# EAGLE design SparkFun_Simultaneous_RFID_Reader_M7E (EAGLE 9.6.2)
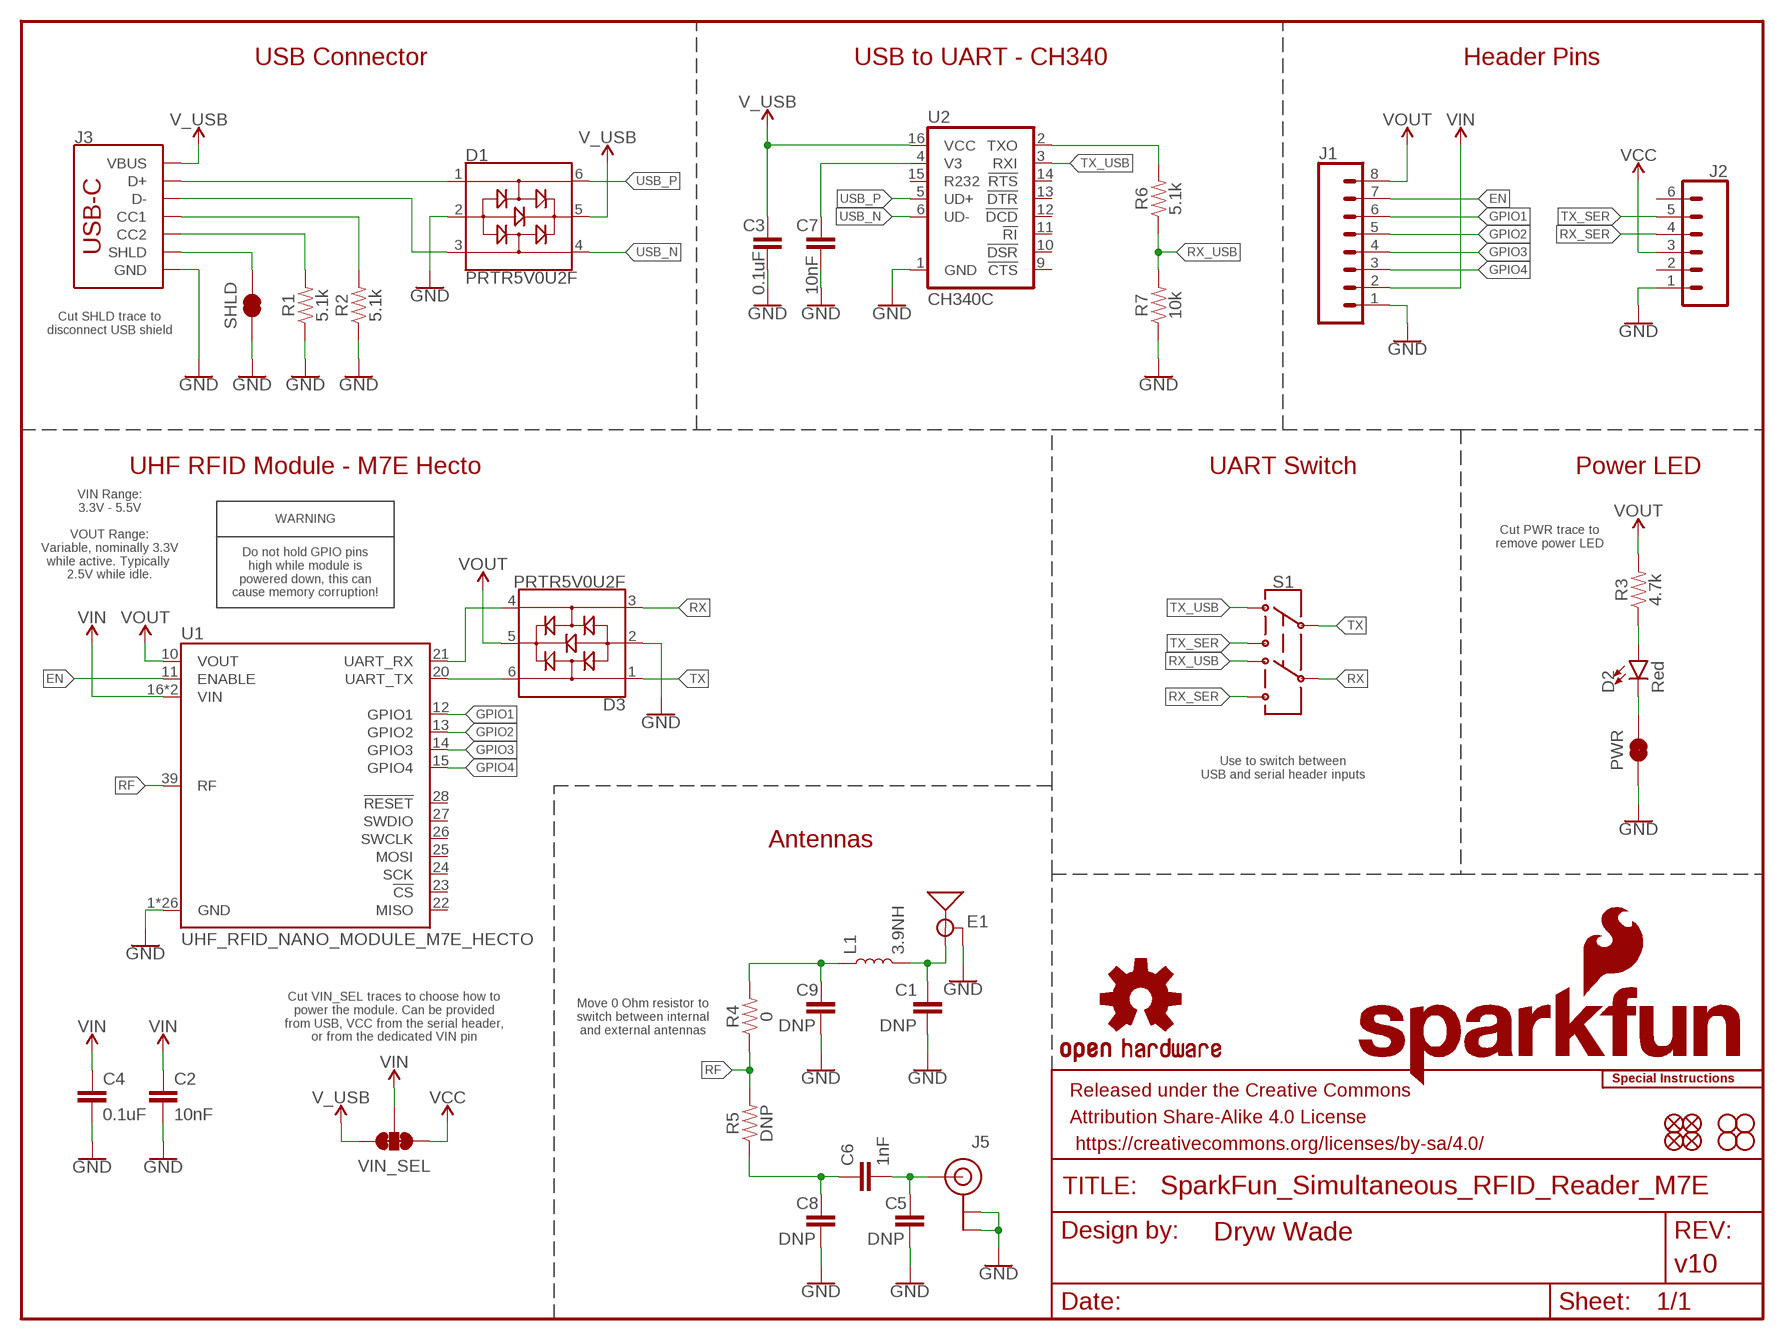
[diagram p0: schematic, sheet 1]

## Parts
C1  DNP  1.0PF-0603-50V-25%  [0603]
C2  10nF  10NF-0603-50V-10%  [0603]
C3  0.1uF  0.1UF-0603-25V-(+80/-20%)  [0603]
C4  0.1uF  0.1UF-0603-25V-(+80/-20%)  [0603]
C5  DNP  1.0PF-0603-50V-25%  [0603]
C6  1nF  1.0NF/1000PF-0603-50V-10%  [0603]
C7  10nF  10NF-0603-50V-10%  [0603]
C8  DNP  1.0PF-0603-50V-25%  [0603]
C9  DNP  1.0PF-0603-50V-25%  [0603]
D1  PRTR5V0U2F  [SOT886]
D2  Red  LED-RED_0603-KB  [LED-0603]
D3  PRTR5V0U2F  [SOT886]
E1  ANTENNA-GROUNDEDTRACE-915MHZ  [TRACE_ANTENNA_915MHZ_THINGMAGIC]
FD1  FIDUCIAL1X2  [FIDUCIAL-1X2]
FD2  FIDUCIAL1X2  [FIDUCIAL-1X2]
FD3  FIDUCIAL1X2  [FIDUCIAL-1X2]
FD4  FIDUCIAL1X2  [FIDUCIAL-1X2]
FRAME1  FRAME-LETTER  [CREATIVE_COMMONS]
H1  STAND-OFF  [STAND-OFF]
H2  STAND-OFF  [STAND-OFF]
H3  STAND-OFF  [STAND-OFF]
H4  STAND-OFF  [STAND-OFF]
J1  CONN_08NO_SILK_DNP  [1X08_NO_SILK]
J2  CONN_06NO_SILK_NO_POP  [1X06_NO_SILK]
J3  USB_C_2-LAYER_PADS  [USB-C-16P-2LAYER-PADS]
J5  U.FL  [U.FL]
L1  3.9NH  [0603]
LOGO1  OSHW-LOGOM  [OSHW-LOGO-M]
LOGO2  SFE_LOGO_NAME_FLAME.2_INCH  [SFE_LOGO_NAME_FLAME_.2]
LOGO3  SFE_LOGO_NAME_FLAME.2_INCH  [SFE_LOGO_NAME_FLAME_.2]
LOGO4  SPECIAL_INSTRUCTIONS-ORDERING  [ORDERING_INSTRUCTIONS]
PWR  JUMPER-SMT_2_NC_TRACE_SILK  [SMT-JUMPER_2_NC_TRACE_SILK]
R1  5.1k  5.1KOHM5.1KOHM-0603-1/10W-1%  [0603]
R2  5.1k  5.1KOHM5.1KOHM-0603-1/10W-1%  [0603]
R3  4.7k  4.7KOHM-0603-1/10W-1%  [0603]
R4  0  0OHM-0603-1/10W  [0603]
R5  DNP  0OHM-0603-1/10W  [0603]
R6  5.1k  5.1KOHM5.1KOHM-0603-1/10W-1%  [0603]
R7  10k  10KOHM-0603-1/10W-1%  [0603]
S1  SWITCH-DPDT-SMD-AYZ0202  [SWITCH_DPDT_SMD_AYZ0202]
SHLD  JUMPER-SMT_2_NC_TRACE_SILK  [SMT-JUMPER_2_NC_TRACE_SILK]
U1  UHF_RFID_NANO_MODULE_M7E_HECTO  [M7E_HECTO_MODULE]
U2  CH340C  [SO016]
VIN_SEL  JUMPER-SMT_3_2-NC_TRACE_SILK  [SMT-JUMPER_3_2-NC_TRACE_SILK]

## Nets
EN: J1.7 U1.11(ENABLE)
GND: C1.2 C2.2 C3.2 C4.2 C5.2 C7.2 C8.2 C9.2 D1.2 D3.2 E1.GND@1(GND) E1.GND@2(GND) E1.GND@3(GND) J1.1 J2.1 J3.GND J3.GND2(GND) J5.1(GND) J5.2(GND) PWR.1 R1.1 R2.1 R7.1 SHLD.1 U1.1(GND) U1.2(GND) U1.3(GND) U1.4(GND) U1.5(GND) U1.6(GND) U1.7(GND) U1.8(GND) U1.9(GND) U1.18(GND) U1.19(GND) U1.29(GND) U1.30(GND) U1.31(GND) U1.32(GND) U1.33(GND) U1.34(GND) U1.35(GND) U1.36(GND) U1.37(GND) U1.38(GND) U1.40(GND) U1.41(GND) U1.GND_PAD1(GND) U1.GND_PAD2(GND) U1.GND_PAD3(GND) U2.1(GND)
GPIO1: J1.6 U1.12(GPIO1)
GPIO2: J1.5 U1.13(GPIO2)
GPIO3: J1.4 U1.14(GPIO3)
GPIO4: J1.3 U1.15(GPIO4)
N$1: C1.1 E1.ANT(SIGNAL) L1.2
N$2: D2.A R3.1
N$3: J3.B5(CC2) R1.2
N$4: J3.A5(CC1) R2.2
N$5: D1.1 J3.A6(D+) J3.B6(D+)
N$6: D2.C PWR.2
N$7: D1.3 J3.A7(D-) J3.B7(D-)
N$8: C6.1 C8.1 R5.1
N$9: C5.1 C6.2 J5.FEED(SIGNAL)
N$10: C9.1 L1.1 R4.2
N$11: C7.1 U2.4(V3)
N$12: D3.6 U1.20(UART_TX)
N$13: D3.4 U1.21(UART_RX)
N$14: R6.2 U2.2(TXO)
RF: R4.1 R5.2 U1.39(RF)
RX: D3.3 S1.5
RX_SER: J2.4 S1.4
RX_USB: R6.1 R7.2 S1.6
SHLD: J3.SHLD1(SHLD) J3.SHLD2(SHLD) J3.SHLD3(SHLD) J3.SHLD4(SHLD) SHLD.2
TX: D3.1 S1.2
TX_SER: J2.5 S1.1
TX_USB: S1.3 U2.3(RXI)
USB_N [USB]: D1.4 U2.6(UD-)
USB_P [USB]: D1.6 U2.5(UD+)
V_USB: C3.1 D1.5 J3.VBUS1(VBUS) J3.VBUS2(VBUS) U2.16(VCC) VIN_SEL.3
VCC: J2.3 VIN_SEL.1
VIN: C2.1 C4.1 J1.2 U1.16(VIN) U1.17(VIN) VIN_SEL.2
VOUT: D3.5 J1.8 R3.2 U1.10(VOUT)
Unconnected: J2.2 J2.6 U1.22(MISO) U1.23(!CS) U1.24(SCK) U1.25(MOSI) U1.26(SWCLK) U1.27(SWDIO) U1.28(!RESET) U2.9(!CTS) U2.10(!DSR) U2.11(!RI) U2.12(!DCD) U2.13(!DTR) U2.14(!RTS) U2.15(R232)

## Notes on the sheet
- USB Connector | USB to UART - CH340 | Header Pins
- Cut SHLD trace to
  disconnect USB shield
- UHF RFID Module - M7E Hecto | UART Switch | Power LED
- VIN Range:
  3.3V - 5.5V
- WARNING
- Cut PWR trace to
  remove power LED
- VOUT Range:
  Variable, nominally 3.3V
  while active. Typically 
  2.5V while idle.
- Do not hold GPIO pins
  high while module is
  powered down, this can
  cause memory corruption!
- Use to switch between
  USB and serial header inputs
- Antennas
- Cut VIN_SEL traces to choose how to
  power the module. Can be provided
  from USB, VCC from the serial header,
  or from the dedicated VIN pin
- Move 0 Ohm resistor to
  switch between internal
  and external antennas

## Library data of the parts
C1 C5 C8 C9 = SparkFun-Capacitors:1.0PF: 1pF ceramic capacitors A capacitor is a passive two-terminal electrical component used to store electrical energy temporarily in an electric field.; VALUE: 1.0pF
C2 C7 = SparkFun-Capacitors:10NF: 0.01uF/10nF/10,000pF ceramic capacitors A capacitor is a passive two-terminal electrical component used to store electrical energy temporarily in an electric field. CAP-09321; PROD_ID: CAP-00867
C3 C4 = SparkFun-Capacitors:0.1UF: 0.1µF ceramic capacitors A capacitor is a passive two-terminal electrical component used to store electrical energy temporarily in an electric field.; PROD_ID: CAP-00810
C6 = SparkFun-Capacitors:1.0NF/1000PF: 1nF/1,000pF ceramic capacitors A capacitor is a passive two-terminal electrical component used to store electrical energy temporarily in an electric field.; PROD_ID: CAP-07886
D1 D3 = SparkFun-IC-Power:PRTR5V0U2: A small ESD protection device. Most commonly used on USB D+/D- signals to protect large, expensive, or especially sensitive USB enabled devices.; PROD_ID: DIO-14084
D2 = SparkFun-LED:LED-RED: Red SMD LED Used in manufacturing of most products at SparkFun Packages: 0603 - KB - KingBright (DIO-17976) SMD 0603 package [Datasheet] <https://www.kingbrightusa.com/images/catalog/SPEC/APT1608SURCK.pdf> 0603 - (DIO-00819, has gone EOL) SMD 0603 package 0603 SMART - SMD 0603 SMART package ( more efficient and expensive)[Product Link] <http://www.osram-os.com/Graphics/XPic2/00077099_0.pdf> 1206 - SMD1206 package [Product Link] <https://www.sparkfun.com/datasheets/DevTools/LilyPad/Q150OVS4.pdff> SparkFun Products: Pro Mini 328 -5V <https://www.sparkfun.com/products/821> RedBoard <https://www.sparkfun.com/products/12757> IOIO-OTG <https://www.sparkfun.com/products/13613>; PROD_ID: DIO-17976
E1 = SparkFun-RF:ANTENNA-GROUNDED: Antenna w/ Ground Connection 2.4GHz antennae with signal and ground terminals. TRACE_ANTENNA_2.4GHZ_15.2MM - Meander Trace antenna 15.2 x 5.7mm footprint Based on layout from TI app note AN043 <http://www.ti.com/lit/an/swra117d/swra117d.pdf>. TRACE_ANTENNA_2.4GHZ_25.7MM - Inverted F trace antenna 25.7 x 7.5 mm footprint. Based on layout from TI design note DN0007 <http://www.ti.com/lit/an/swru120b/swru120b.pdf>.
FD1-FD4 = SparkFun-Aesthetics:FIDUCIAL: Fiducial Alignment Points Point-of-reference for pick-and-place machines and other optical instruments.
FRAME1 = SparkFun-Aesthetics:FRAME-LETTER: Schematic Frame - Letter Standard 8.5x11 US Letter frame; DESIGNER: Dryw Wade; REV: v10
H1-H4 = SparkFun-Hardware:STAND-OFF: Stand Off Drill holes for mechanically mounting via screws, standoffs, etc. Note: Use the keepout ring to avoid running the screw head into surrounding components. Variant Overviews STAND-OFF - Mechanical footprint for a #4 phillips button head screw. STAND-OFF-TIGHT - Mechanical footprint for a #4 phillips button head screw, Example SparkFun Products Screw - Phillips Head (1/4", 4-40, 10 pack) <https://www.sparkfun.com/products/10453> (PRT-10453) Screw - Phillips Head (1/2", 4-40, 10 pack) <https://www.sparkfun.com/products/10452> (PRT-10452) Screw - Phillips Head (3/4", 4-40, 10 pack) <https://www.sparkfun.com/products/10451> (PRT-10451) Screw - Phillips Head (1", 4-40, 10 pack) <https://www.sparkfun.com/products/10450> (PRT-10450)
J1 = SparkFun-Connectors:CONN_08: Multi connection point. Often used as Generic Header-pin footprint for 0.1 inch spaced/style header connections On any of the 0.1 inch spaced packages, you can populate with these: Break Away Headers - Straight <https://www.sparkfun.com/products/116> (PRT-00116) Break Away Male Headers - Right Angle <https://www.sparkfun.com/products/553> (PRT-00553) Female Headers <https://www.sparkfun.com/products/115> (PRT-00115) Break Away Headers - Machine Pin <https://www.sparkfun.com/products/117> (PRT-00117) Break Away Female Headers - Swiss Machine Pin <https://www.sparkfun.com/products/743> (PRT-00743) Arduino Stackable Header - 8 Pin <https://www.sparkfun.com/products/9279> (PRT-09279) For SCREWTERMINALS and SPRING TERMINALS visit here: Screw Terimnals on SparkFun.com <https://www.sparkfun.com/search/results?term=Screw+Terminals> (5mm/3.5mm/2.54mm spacing) This device is also useful as a general connection point to wire up your design to another part of your project. Our various solder wires solder well into these plated through hole pads. Hook-Up Wire - Assortment (Stranded, 22 AWG) <https://www.sparkfun.com/products/11375> (PRT-11375) Hook-Up Wire - Assortment (Solid Core, 22 AWG) <https://www.sparkfun.com/products/11367> (PRT-11367) View the entire wire category on our website here <https://www.sparkfun.com/categories/141> Special notes: Molex polarized connector foot print use with SKU : PRT-08231 with associated crimp pins and housings. 1MM SMD Version SKU: PRT-10208 NOTES ON THE VARIANTS LOCK and LOCK_LONGPADS... This footprint was designed to help hold the alignment of a through-hole component (i.e. 6-pin header) while soldering it into place. You may notice that each hole has been shifted either up or down by 0.005 of an inch from it's more standard position (which is a perfectly straight line). This slight alteration caused the pins (the squares in the middle) to touch the edges of the holes. Because they are alternating, it causes a "brace" to hold the component in place. 0.005 has proven to be the perfect amount of "off-center" position when using our standard breakaway headers. Although looks a little odd when you look at the bare footprint, once you have a header in there, the alteration is very hard to notice. Also,if you push a header all the way into place, it is covered up entirely on the bottom side.
J2 = SparkFun-Connectors:CONN_06: Multi connection point. Often used as Generic Header-pin footprint for 0.1 inch spaced/style header connections On any of the 0.1 inch spaced packages, you can populate with these: Break Away Headers - Straight <https://www.sparkfun.com/products/116> (PRT-00116) Break Away Male Headers - Right Angle <https://www.sparkfun.com/products/553> (PRT-00553) Female Headers <https://www.sparkfun.com/products/115> (PRT-00115) Break Away Headers - Machine Pin <https://www.sparkfun.com/products/117> (PRT-00117) Break Away Female Headers - Swiss Machine Pin <https://www.sparkfun.com/products/743> (PRT-00743) Arduino Stackable Header - 6 Pin <https://www.sparkfun.com/products/9280> (PRT-09280) Screw Terminals 2.54mm Pitch (6-Pin) <https://www.sparkfun.com/products/16499> (PRT-16499) For SCREWTERMINALS and SPRING TERMINALS visit here: Screw Terimnals on SparkFun.com <https://www.sparkfun.com/search/results?term=Screw+Terminals> (5mm/3.5mm/2.54mm spacing) This device is also useful as a general connection point to wire up your design to another part of your project. Our various solder wires solder well into these plated through hole pads. Hook-Up Wire - Assortment (Stranded, 22 AWG) <https://www.sparkfun.com/products/11375> (PRT-11375) Hook-Up Wire - Assortment (Solid Core, 22 AWG) <https://www.sparkfun.com/products/11367> (PRT-11367) View the entire wire category on our website here <https://www.sparkfun.com/categories/141>
J3 = SparkFun-Connectors:USB_C: USB Type C 16Pin Connector Super Speed pins not available on the 16-pin purely SMD connector so this part is best for USB 2.0 implementations. D1 and D2 are tied together enabling D+/- no matter which way the cable is plugged into the connector. The two channel configuration pins (CC1/2) are exposed. These are normally connected to ground via 5.1k resistors but can be reconfigured for high current/high power applications. **4-LAYER BOARD WARNING!!** If designing 4-layer board, make sure to select the variant _4-LAYER-ISOLATED. The linked footprint (USB-C-16-4LAYER-ISOLATED) includes some very necessary cutout polygons in the inner layers (2 and 15). This prevents the PTH mounting shield legs on the USB connector from electrically connecting any other polygons on the inner layers (usually VCC and GND).; PROD_ID: CONN-14122
J5 = SparkFun-Connectors:U.FL: SMD Antenna Connector - U.FL 2mm height, 3.0mm x 3.0mm receptacle size. SparkFun Products: SparkFun WiFi Shield - ESP8266 <https://www.sparkfun.com/products/13287> SparkFun ESP8266 Thing <https://www.sparkfun.com/products/13231> SparkFun MiniGen - Pro Mini Signal Generator Shield <https://www.sparkfun.com/products/11420>; PROD_ID: CONN-09193; SF_ID: WRL-09144
L1 = SparkFun-Coils:3.9NH; PROD_ID: NDUC-08761
LOGO1 = SparkFun-Aesthetics:OSHW-LOGO: Open-Source Hardware (OSHW) Logo This logo indicates the piece of hardware it is found on incorporates a OSHW license and/or adheres to the definition of open source hardware found here: http://freedomdefined.org/OSHW
LOGO2 LOGO3 = SparkFun-Aesthetics:SFE_LOGO_NAME_FLAME: SparkFun Font Logo w/ Flame This is the SparkFun full logo. The logo on the schematic will always be the same size; the package variant is the height of the flame part of the logo. Default layer for the logo on the board is tSilk.
LOGO4 = SparkFun-Aesthetics:SPECIAL_INSTRUCTIONS: Special Ordering/Production Instructions Alert Symbol for special PCB ordering instructions or unique production process warnings. Ordering Instructions Production Instructions Types of information that should be added to box: Copper weight Soldermask color Silk color PCB thickness Number of layers PCB Standard: 1.6mm FR4 1 oz copper immersion silver plating red soldermask white silkscreen Types of information that should be added to box: Special wash requirements Depaneling instructions Humidification Glue curing Default text settings: 0.07 inch 9% ratio 50% line distance
PWR SHLD = SparkFun-Jumpers:JUMPER-SMT_2_NC_TRACE: Normally closed trace jumper This jumper has a trace between two pads so it's normally closed (NC). Use a razor knife to open the connection. For best results follow the IPC guidelines for cutting traces: Cutout at least 0.063 mm (0.005 in). Remove all loose material to clean up the cut area. Seal the cut with an approved epoxy. Reapply solder to reclose the connection.
R1 R2 R6 = SparkFun-Resistors:5.1KOHM; PROD_ID: RES-12083
R3 = SparkFun-Resistors:4.7KOHM: 4.7kΩ resistor A resistor is a passive two-terminal electrical component that implements electrical resistance as a circuit element. Resistors act to reduce current flow, and, at the same time, act to lower voltage levels within circuits. - Wikipedia; PROD_ID: RES-07857
R4 = SparkFun-Resistors:0OHM: 0Ω resistor A resistor is a passive two-terminal electrical component that implements electrical resistance as a circuit element. Resistors act to reduce current flow, and, at the same time, act to lower voltage levels within circuits. - Wikipedia; PROD_ID: RES-08609
R5 = SparkFun-Resistors:0OHM: 0Ω resistor A resistor is a passive two-terminal electrical component that implements electrical resistance as a circuit element. Resistors act to reduce current flow, and, at the same time, act to lower voltage levels within circuits. - Wikipedia; VALUE: 0
R7 = SparkFun-Resistors:10KOHM: 10kΩ resistor A resistor is a passive two-terminal electrical component that implements electrical resistance as a circuit element. Resistors act to reduce current flow, and, at the same time, act to lower voltage levels within circuits. - Wikipedia; PROD_ID: RES-00824
S1 = SparkFun-Switches:SWITCH-DPDT: Double-Pole, Double-Throw (DPDT) Switch Double-pole, double-throw switches. Variant Overview PTH-GPI-152-3013 Used on SparkFun Geiger Counter <https://www.sparkfun.com/products/11345> SMD-AY0202 Surface Mount DPDT Switch <https://www.sparkfun.com/products/597> (COM-00597) Used on e.g. LilyPad Arduino USB - ATmega32U4 Board <https://www.sparkfun.com/products/12049>; PROD_ID: SWCH-08179; SF_SKU: COM-00597
U1 = SparkFun-RF:UHF_RFID_NANO_MODULE: UHF 860 and 920MHz RFID Module from ThingMagic; PROD_ID: IC-21210
U2 = SparkFun-IC-Comms:CH340C; PROD_ID: IC-14038
VIN_SEL = SparkFun-Jumpers:JUMPER-SMT_3_2-NC_TRACE: Normally closed trace jumper (2 of 2 connections) This jumper has a trace between all three pads so they are normally closed (NC). Use a razor knife to open the connection(s). For best results follow the IPC guidelines for cutting traces: Cutout at least 0.063 mm (0.005 in). Remove all loose material to clean up the cut area. Seal the cut with an approved epoxy. Reapply solder to reclose the connection(s).

## Net classes
1 USB: width 0.185 mm, clearance 0.127 mm

## Board
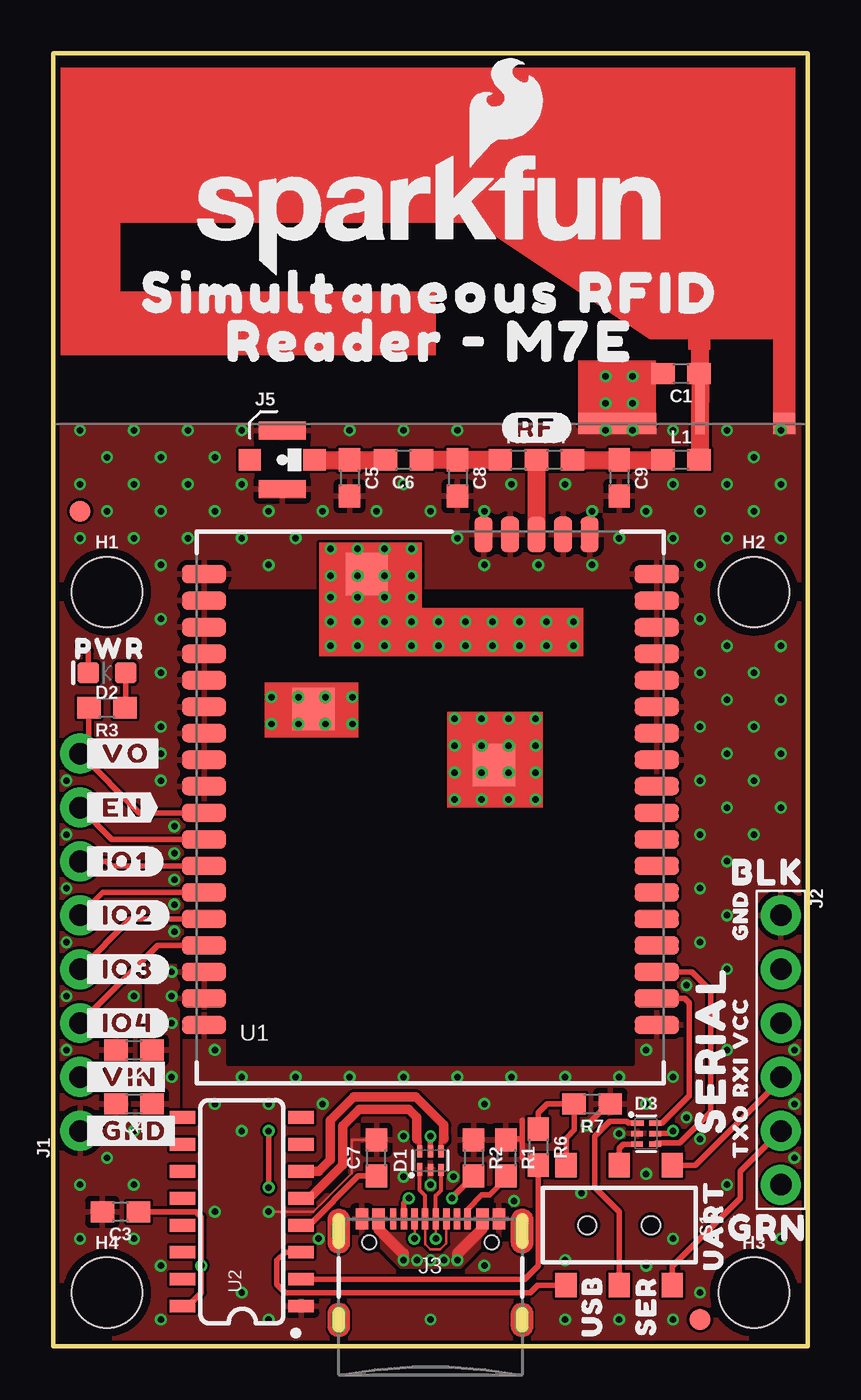
[diagram p1: board, top side]
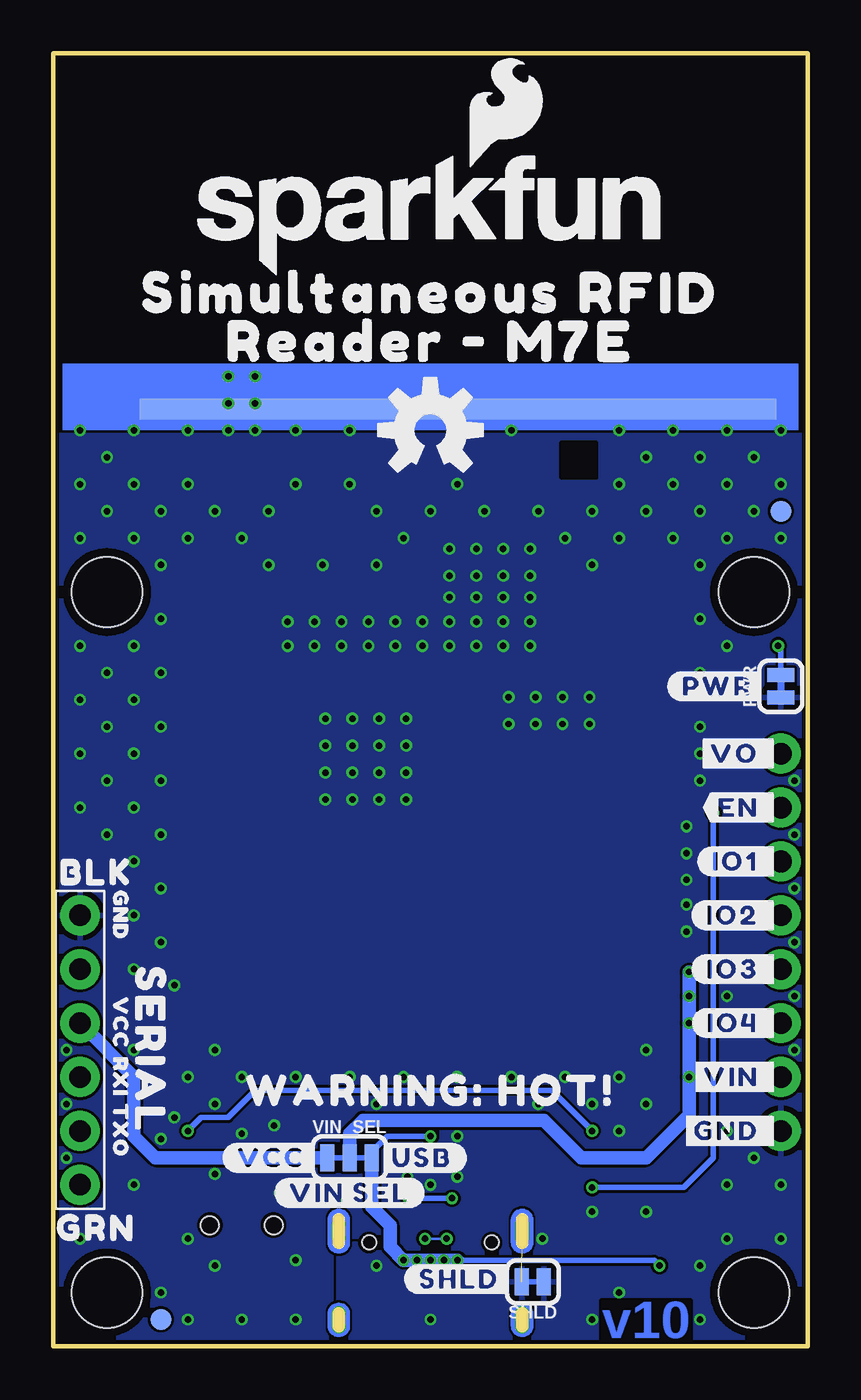
[diagram p2: board, bottom side, seen from below]

Size 35.56 x 60.96 mm. Coordinates in mm from the lower left corner, seen from the top.
Outline: 0,0 35.56,0 35.56,60.96 0,60.96 0,0
Copper layers (1*16): Top 0.035mm / dielectric 1.5mm / Bottom 0.035mm
Design rules "SparkFun-2-Layer-Minimum-JLCPCB": minimum track width 5mil, minimum drill 0.3mm, track to track 5mil, track to pad 5mil, pad to pad 5mil, via to via 5mil, smd to smd 5mil, copper to edge 7mil, drill to drill 7mil, minimum pad ring 5mil, minimum via ring 5mil, stop-mask expansion 2.5mil, vias tented up to drill 25mil, thermal gap 10mil
tRestrict: area 16.3,41.3 to 16.8,42.3; area 21.7,41.3 to 22.2,42.3; area 23.4,41.3 to 23.9,42.3; area 29.3,41.3 to 29.8,42.3

### Footprints (pad centres in the part's own frame; a part is rotated, then mirrored left to right if it is on the bottom)
0603 = smd 1.1 x 1: 1 -0.85,0; 2 0.85,0
SOT886 = smd 0.61 x 0.25: 1 -0.405,0.5 | smd 0.56 x 0.25: 2 -0.43,0; 3 -0.43,-0.5; 4 0.43,-0.5; 5 0.43,0; 6 0.43,0.5
LED-0603 = smd 1 x 1: A -0.877,0; C 0.877,0
TRACE_ANTENNA_915MHZ_THINGMAGIC = smd 0.44 x 3: ANT -0.006,-1.315 | smd 1.02 x 1: GND@1 -3.966,-0.315 | smd 3.677 x 1: GND@2 3.909,-0.315 | smd 30 x 1 bottom: GND@3 14,-1
FIDUCIAL-1X2 = smd 1 x 1: 1 0,0
STAND-OFF = hole 3.302: 0,0
1X08_NO_SILK = drill 1.016 pad 1.88: 1 0,0; 2 2.54,0; 3 5.08,0; 4 7.62,0; 5 10.16,0; 6 12.7,0; 7 15.24,0; 8 17.78,0
1X06_NO_SILK = drill 1.016 pad 1.88: 1 0,0; 2 2.54,0; 3 5.08,0; 4 7.62,0; 5 10.16,0; 6 12.7,0
USB-C-16P-2LAYER-PADS = smd 0.3 x 1: A5 -1.25,-0.34; A6 -0.25,-0.34; A7 0.25,-0.34; A8 1.25,-0.34; B5 1.75,-0.34; B6 0.75,-0.34; B7 -0.75,-0.34; B8 -1.75,-0.34 | smd 0.6 x 1: GND -3.225,-0.34; GND2 3.225,-0.34; VBUS1 -2.45,-0.34; VBUS2 2.45,-0.34 | drill 0.4 pad 0.6 long: SHLD1 -4.318,-0.915; SHLD2 4.318,-0.915; SHLD3 -4.318,-5.095; SHLD4 4.318,-5.095 | hole 0.65: -2.89,-1.445; 2.89,-1.445
U.FL = smd 2.2 x 0.85: 1 0,1.375; 2 0,-1.375 | smd 1.05 x 1: FEED 1.525,0; NC -1.525,0
SMT-JUMPER_2_NC_TRACE_SILK = smd 0.66 x 1.27: 1 -0.521,0; 2 0.521,0
SWITCH_DPDT_SMD_AYZ0202 = smd 1 x 1.15: 1 -2.5,2.825; 2 0,2.825; 3 2.5,2.825; 4 -2.5,-2.825; 5 0,-2.825; 6 2.5,-2.825 | hole 0.85: 1.5,0; -1.5,0
M7E_HECTO_MODULE = smd 2.075 x 0.85: 1 -10.662,11; 2 -10.662,9.75; 3 -10.662,8.5; 4 -10.662,7.25; 5 -10.662,6; 6 -10.662,4.75; 7 -10.662,3.5; 8 -10.662,2.25; 9 -10.662,1; 10 -10.662,-0.25; 11 -10.662,-1.5; 12 -10.662,-2.75; 13 -10.662,-4; 14 -10.662,-5.25; 15 -10.662,-6.5; 16 -10.662,-7.75; 17 -10.662,-9; 18 -10.662,-10.25; 19 10.662,-10.25; 20 10.662,-9; 21 10.662,-7.75; 22 10.662,-6.5; 23 10.662,-5.25; 24 10.662,-4; 25 10.662,-2.75; 26 10.662,-1.5; 27 10.662,-0.25; 28 10.662,1; 29 10.662,2.25; 30 10.662,3.5; 31 10.662,4.75; 32 10.662,6; 33 10.662,7.25; 34 10.662,8.5; 35 10.662,9.75; 36 10.662,11 | smd 0.85 x 1.665: 37 7.5,12.867; 38 6.25,12.867; 39 5,12.867; 40 3.75,12.867; 41 2.5,12.867 | smd 2 x 2: GND_PAD1 3,2; GND_PAD2 -3,11; GND_PAD3 -5.5,4.625
SO016 = smd 0.6 x 1.2: 1 -4.445,-2.8; 2 -3.175,-2.8; 3 -1.905,-2.8; 4 -0.635,-2.8; 5 0.635,-2.8; 6 1.905,-2.8; 7 3.175,-2.8; 8 4.445,-2.8; 9 4.445,2.8; 10 3.175,2.8; 11 1.905,2.8; 12 0.635,2.8; 13 -0.635,2.8; 14 -1.905,2.8; 15 -3.175,2.8; 16 -4.445,2.8
SMT-JUMPER_3_2-NC_TRACE_SILK = smd 0.66 x 1.27: 1 -1.041,0; 2 0,0; 3 1.041,0

### Placement (x,y rotation side)
C1  29.59,45.85 180 top
C2  3.81,13.97 180 top
C3  3.17,6.35 180 top
C4  3.81,11.43 180 top
C5  13.97,40.93 270 top
C6  16.51,41.78 180 top
C7  15.24,8.89 90 top
C8  19.05,40.93 270 top
C9  26.67,40.93 270 top
D1  17.78,8.76 90 top
D2  2.54,31.75 180 top
D3  27.94,10.03 0 top
E1  30.48,43.18 180 top
FD1  30.48,1.27 0 top
FD2  30.48,1.27 0 bottom
FD3  1.27,39.37 0 top
FD4  1.27,39.37 0 bottom
FRAME1  -5.28,-25.42 0 top  (outside the outline)
H1  2.54,35.56 0 top
H2  33.02,35.56 0 top
H3  33.02,2.54 0 top
H4  2.54,2.54 0 top
J1  1.27,10.16 90 top
J2  34.29,20.32 270 top
J3  17.78,6.35 0 top
J5  10.79,41.78 0 top
L1  29.59,41.78 0 top
LOGO1  17.78,43.18 0 bottom
LOGO2  17.78,53.34 0 top
LOGO3  17.78,53.34 0 bottom
LOGO4  46.99,50.8 0 top  (outside the outline)
PWR  1.27,31.11 90 bottom
R1  21.34,8.89 270 top
R2  19.81,8.89 270 top
R3  2.54,30.1 180 top
R4  23.62,41.78 0 top
R5  21.92,41.78 0 top
R6  22.86,9.4 270 top
R7  25.4,11.43 180 top
S1  26.67,5.71 180 top
SHLD  12.95,3.05 180 bottom
U1  17.78,25.4 0 top
U2  8.89,6.35 90 top
U$1  [SIMULTANEOUS_RFID0]  17.78,49.66 0 bottom
U$2  [READER_#_M7E0]  17.78,47.37 0 bottom
U$3  [#USB#0]  20.32,8.89 0 bottom
U$4  [#VCC#0]  22.99,8.89 0 bottom
U$5  [SERIAL0]  30.99,13.97 270 bottom
U$6  [#_GND#0]  1.27,10.16 0 top
U$7  [SERIAL0]  30.99,13.97 90 top
U$8  [UART0]  31.11,5.71 90 top
U$10  [#_VIN#0]  1.27,12.7 0 top
U$11  [#_IO4#0]  1.27,15.24 0 top
U$12  [#_IO3#0]  1.27,17.78 0 top
U$13  [#_IO2#0]  1.27,20.32 0 top
U$14  [#_IO1#0]  1.27,22.86 0 top
U$15  [#_EN#0]  1.27,25.4 0 top
U$16  [SER0]  27.94,1.91 90 top
U$17  [#VIN_SEL#0]  21.59,7.24 0 bottom
U$18  [#VO_#0]  1.27,27.94 0 bottom
U$19  [SIMULTANEOUS_RFID0]  17.78,49.66 0 top
U$20  [READER_#_M7E0]  17.78,47.37 0 top
U$21  [#_VO#0]  1.27,27.94 0 top
U$27  [#GND_#0]  1.27,10.16 0 bottom
U$39  [#EN_#0]  1.27,25.4 0 bottom
U$40  [#IO1_#0]  1.27,22.86 0 bottom
U$41  [#IO2_#0]  1.27,20.32 0 bottom
U$42  [#IO3_#0]  1.27,17.78 0 bottom
U$43  [#IO4_#0]  1.27,15.24 0 bottom
U$44  [#VIN_#0]  1.27,12.7 0 bottom
U$45  [USB0]  25.4,1.91 90 top
U$49  [#PWR#0]  1.91,31.11 0 bottom
U$50  [#SHLD#0]  13.84,3.17 0 bottom
U$52  [PWR0]  2.67,32.89 0 top
U$56  [#RF#0]  22.78,43.31 0 top
U$57  [WARNING#_HOT##0]  17.78,12.06 0 bottom
VIN_SEL  21.59,8.89 0 bottom

### Tracks (layer width: path | path; a pad name or v marks a point on that pad's centre or on a via)
EN
  Top 0.254: U1.11 2.77,23.9 J1.7
GND  (via drill 0.3)
  Top 0.127: v10.16,6.35 12.25,6.35 14.07,8.17 14.07,9.74 C7.2
  Top 0.254: C1.2 27.43,45.85 v27.3,45.72 | U1.GND_PAD1 20.43,27.05 v20.19,27.05 | U1.GND_PAD3 12.28,30.06 v12.83,30.61 | R1.1 21.38,9.78 22.1,9.78 | 22.1,8.89 22.1,9.78 | 22.1,9.78 22.1,10.67 | v25.15,10.41 26.16,11.43 R7.1
  other vias: 10.29,30.61 18.92,29.59 20.19,29.59 21.46,29.59 22.73,29.59 22.73,28.32 21.46,28.32 20.19,28.32 18.92,28.32 10.29,29.34 11.56,30.61 18.92,27.05 21.46,27.05 22.73,27.05 22.73,25.78 21.46,25.78 20.19,25.78 18.92,25.78 11.56,29.34 14.1,29.34 14.1,30.61 12.83,29.34 23.24,34.16 23.24,33.02 21.97,33.02 21.97,34.16 20.7,34.16 20.7,33.02 19.43,33.02 19.43,34.16 18.16,34.16 18.16,33.02 16.89,33.02 16.89,34.16 15.62,34.16 15.62,33.02 14.35,33.02 14.35,34.16 13.08,34.16 13.08,33.02 13.08,35.31 14.35,35.31 15.62,35.31 16.89,35.31 16.89,36.32 15.62,36.32 14.35,36.32 13.08,36.32 13.08,37.59 14.35,37.59 15.62,37.59 16.89,37.59 19.05,38.1 20.32,36.83 11.43,38.1 8.89,38.1 10.16,36.83 26.04,44.45 27.3,44.45 27.3,43.18 26.04,43.18 26.04,45.72 5.71,19.56 5.71,20.83 5.71,22 5.71,23.24 5.71,24.51 2.54,41.91 3.81,40.64 6.35,40.64 1.27,43.18 10.16,39.37 8.89,40.64 8.89,43.18 7.62,41.91 16.51,40.64 17.78,39.37 20.32,39.37 21.59,40.64 27.94,39.37 30.48,39.37 33.02,39.37 1.27,40.64 5.08,41.91 3.81,43.18 13.97,43.18 16.51,43.18 19.05,43.18 21.59,43.18 24.13,40.64 34.29,40.64 33.02,41.91 22.86,36.83 25.4,39.37 31.75,38.1 30.48,36.83 31.75,33.02 31.75,30.48 31.75,27.94 34.29,38.1 33.02,31.75 34.29,33.02 33.02,29.21 3.81,38.1 5.08,36.83 3.81,33.02 5.08,27.94 5.08,1.27 3.81,5.08 1.27,7.62 3.81,10.16 10.16,11.43 12.7,11.43 20.32,11.43 29.21,12.7 26.67,10.03 17.78,7.62 7.62,6.35 10.16,1.27 7.62,11.43 8.89,10.16 8.89,2.54 5.08,26.67 5.08,31.75 5.08,29.21 5.08,34.29 6.35,38.1 26.67,38.1 29.21,38.1 31.75,40.64 30.48,34.29 30.48,31.75 30.48,29.21 11.43,12.7 13.97,12.7 16.51,12.7 19.05,12.7 21.59,12.7 24.13,12.7 26.67,12.7 16.51,9.91 16.51,8 18.86,8 1.27,5.08 2.54,8.89 0.64,16.51 0.64,13.97 0.64,19.05 0.64,26.67 0.64,21.59 0.64,24.13 34.29,5.08 7.62,13.97 8.89,12.7 27.94,13.97 3.81,16.51 5.08,3.81 6.35,43.18 24.13,43.18 29.21,40.64 29.21,43.18 31.75,43.18 34.29,43.18 12.7,39.37 2.54,39.37 1.27,38.1 5.08,39.37 7.62,39.37 34.29,30.48 34.29,27.94 33.02,26.67 30.48,26.67 31.75,25.4 34.29,25.4 33.02,24.13 30.48,24.13 30.48,21.59 30.48,19.05 31.75,22.86 31.75,20.32 31.75,17.78 27.94,11.43 29.84,17.02 29.84,10.79 24.13,4.06 27.94,8.13 29.21,5.08 24.13,1.27 26.67,1.27 29.21,1.27 30.48,2.54 27.94,3.81 34.92,11.43 34.92,13.97 34.92,8.89 30.48,9.78 21.72,6.86 31.75,13.97 31.75,7.62 3.81,7.62 15.24,39.37 24.51,34.16 24.51,33.02 25.4,36.83 12.51,5.08 24.89,7.24
  pour Top (isolate 0.127, rank 3): 0,0 35.56,0 35.56,43.43 0,43.43
  pour Bottom (isolate 0.127, rank 2): 35.56,0 0,0 0,43.43 35.56,43.43
  pour Top (isolate 0.127, no thermals): 24.13,43.43 24.13,41.91 29.21,41.91 29.21,43.43
  pour Bottom (isolate 0.127, no thermals): 0,46.23 35.56,46.23 35.56,41.91 0,41.91
  pour Top (isolate 0.127, no thermals): 33.02,43.43 33.02,41.91 35.56,41.91 35.56,43.43
GPIO1
  Top 0.254: U1.12 2.75,22.65 2.54,22.86 J1.6
GPIO2
  Top 0.254: U1.13 2.35,21.4 J1.5
GPIO3
  Top 0.254: U1.14 3.64,20.15 J1.4
GPIO4
  Top 0.254: U1.15 4.93,18.9 J1.3
N$1
  Top 0.859: 30.48,46.99 30.48,45.89 C1.1 30.49,45.8 E1.ANT 30.49,41.83 L1.2
N$2
  Top 0.254: R3.1 3.42,30.13 D2.A
N$3
  Top 0.254: J3.B5 19.53,6.47 20.21,7.14 20.57,7.14 21.34,7.91 R1.2
N$4  (via drill 0.3)
  Top 0.254: v16.76,6.99 16.53,6.75 J3.A5 | R2.2 18.8,7.02 v18.8,6.99
  Bottom 0.254: v16.76,6.99 v18.8,6.99
N$5
  Top 0.127: J3.A6 17.53,4.82 17.78,4.57 18.24,4.57 18.53,4.86 J3.B6
  Top 0.185: J3.A6 17.53,7.11 17.28,7.36 D1.1
N$6  (via drill 0.3)
  Top 0.254: D2.C 1.66,32.75 v1.4,33.02
  Bottom 0.254: v1.4,33.02 1.27,32.89 PWR.2
N$7  (via drill 0.3)
  Top 0.127: J3.B7 17.03,5.09 v17.02,5.08 | J3.A7 v18.03,5.08
  Top 0.185: J3.A7 18.03,7.11 18.28,7.36 D1.3
  Bottom 0.127: v18.03,5.08 v17.02,5.08
N$8
  Top 0.859: R5.1 C8.1 C6.1
N$9
  Top 0.859: J5.FEED C5.1 C6.2
N$10
  Top 0.859: R4.2 C9.1 L1.1
N$11
  Top 0.254: U2.4 12.06,5.71 14.39,8.04 C7.1
N$12
  Top 0.254: D3.6 28.69,10.53 29.97,11.81 29.97,16.18 29.75,16.4 U1.20
N$13
  Top 0.254: U1.21 30.1,17.65 30.99,16.76 30.99,11.05 29.53,9.59 28.43,9.59 D3.4
N$14
  Top 0.254: U2.2 22.23,3.17 22.86,3.81 R6.2
RF
  Top 0.859: U1.39 R4.1
RX
  Top 0.254: S1.5 26.67,9.33 26.88,9.53 D3.3
RX_SER
  Top 0.254: S1.4 30.26,8.54 34.29,12.57 J2.4
RX_USB
  Top 0.254: R6.1 22.86,11.01 23.28,11.43 R7.2 24.55,10.2 24.17,9.82 S1.6
SHLD  (via drill 0.3)  (1 unrouted)
  other vias: 20.32,3.81 17.78,1.27
  pour Bottom (isolate 0.127): 13.46,4.83 13.46,0 22.1,0 22.1,4.83
  pour Top (isolate 0.127, rank 2): 22.1,4.83 22.1,0 13.46,0 13.46,4.83
TX
  Top 0.254: D3.1 27.11,10.53 27.03,10.6 26.23,10.6 25.53,9.91 25.53,7.49 26.67,6.35 S1.2
TX_SER
  Top 0.254: J2.5 32.38,8.26 32.38,6.99 29.17,3.77 S1.1
TX_USB
  Top 0.254: U2.3 10.93,4.45 10.54,4.06 10.54,2.94 10.94,2.54 22.48,2.54 22.83,2.89 S1.3
USB_N
  Top 0.185: D1.4 18.28,9.64 18.41,9.78
  Top 0.457: U2.6 12.51,8.26 13.06,8.8 13.06,10.65 14.17,11.77 17.09,11.77 18.41,10.44 18.41,9.78
  pour Top (isolate 0.127, no thermals): 18.26,9.42 18.26,9.91 18.54,9.91 18.54,9.7
USB_P
  Top 0.185: D1.6 17.28,9.64 17.14,9.78
  Top 0.457: U2.5 12.08,6.99 13.65,8.56 13.65,10.4 14.43,11.18 16.76,11.18 17.14,10.79 17.14,9.78
  pour Top (isolate 0.127, no thermals): 17.3,9.42 17.3,9.91 17.02,9.91 17.02,9.7
V_USB  (via drill 0.3)
  Top 0.254: D1.5 v17.78,9.91 | U2.16 6.35,1.91 6.99,2.54 v6.99,3.81 6.99,6.1 6.73,6.35 C3.1
  Top 0.508: J3.VBUS1 15.33,5.55 16.51,4.37 v16.51,4.06 | J3.VBUS2 20.23,5.55 19.05,4.37 v19.05,4.06
  Bottom 0.254: v17.78,9.91 19.81,9.91 20.55,9.17 VIN_SEL.3 | v16.51,4.06 7.24,4.06 v6.99,3.81
  Bottom 0.635: v16.51,4.06 v17.14,4.06 v17.78,4.06 v18.41,4.06 v19.05,4.06 19.68,4.7 19.68,5.71 20.55,6.58 VIN_SEL.3
  pour Top (isolate 0.127): 15.24,6.35 15.24,4.95 16.38,3.81 19.18,3.81 20.32,4.95 20.32,6.35
VCC
  Bottom 0.635: J2.3 31.75,12.7 31.75,9.91 30.73,8.89 VIN_SEL.1
VIN  (via drill 0.3)
  Bottom 0.635: v5.59,17.65 v5.59,16.51 v5.59,15.24 v5.59,12.7 5.59,10.92 7.62,8.89 10.67,8.89 12.45,10.67 20.95,10.67 21.59,10.03 VIN_SEL.2
  pour Top (isolate 0.127): 0,13.21 4.45,13.21 4.45,17.91 8.38,17.91 8.38,16 5.84,16 5.84,11.05 3.81,11.05 3.81,12.19 0,12.19
VOUT  (via drill 0.3)
  Top 0.254: U1.10 v4.45,25.15 4.06,25.15 J1.8 1.69,28.36 R3.2 | v10.16,7.49 v10.16,10.16 | D3.5 29.08,10.03 v29.21,10.16
  Bottom 0.254: v4.45,25.15 4.45,8.89 5.84,7.49 v10.16,7.49 | v10.16,10.16 12.06,12.06 26.04,12.06 27.3,10.79 28.57,10.79 v29.21,10.16

### Text on the board
Bottom: v10
Measures: Units: inches
tDocu: 2-layer / 1oz copper / Board thickness: 1.6mm / Material: TG135-140 / Soldermask: Red / Silkscreen: White / Surface Finish: Lead-Free HASL | Dryw Wade